# EAGLE design DigitalOutLED-02 (EAGLE 6.2)
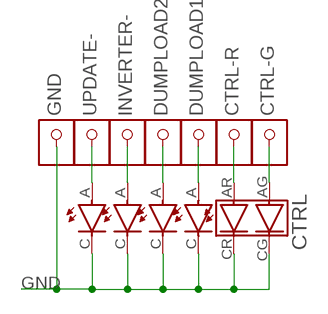
[diagram p0: schematic, sheet 1]

## Parts
CTRL  PLCC4-RG  [PLCC4]
CTRL-G  1X1HEADER  [1X1HEADER]
CTRL-R  1X1HEADER  [1X1HEADER]
DL1  PLCC2  [PLCC2]
DL2  PLCC2  [PLCC2]
DUMPLOAD1  1X1HEADER  [1X1HEADER]
DUMPLOAD2  1X1HEADER  [1X1HEADER]
GND  1X1HEADER  [1X1HEADER]
INVERTER  PLCC2  [PLCC2]
INVERTER-  1X1HEADER  [1X1HEADER]
UPDATE  PLCC2  [PLCC2]
UPDATE-  1X1HEADER  [1X1HEADER]

## Nets
GND: CTRL.CG CTRL.CR DL1.C DL2.C GND.P$1 INVERTER.C UPDATE.C
N$1: UPDATE-.P$1 UPDATE.A
N$2: INVERTER-.P$1 INVERTER.A
N$3: DL2.A DUMPLOAD2.P$1
N$4: DL1.A DUMPLOAD1.P$1
N$5: CTRL-R.P$1 CTRL.AR
N$6: CTRL-G.P$1 CTRL.AG

## Library data of the parts
CTRL = PCB_ControlStack:PLCC4-RG
CTRL-G CTRL-R DUMPLOAD1 DUMPLOAD2 GND INVERTER- UPDATE- = headers v6-2:1X1HEADER: Standard 1x1way male/female header. 2.54mm pitch. Through-Hole. Use to create custom length headers by stacking.
DL1 DL2 INVERTER UPDATE = PCB_ControlStack:PLCC2

## Board
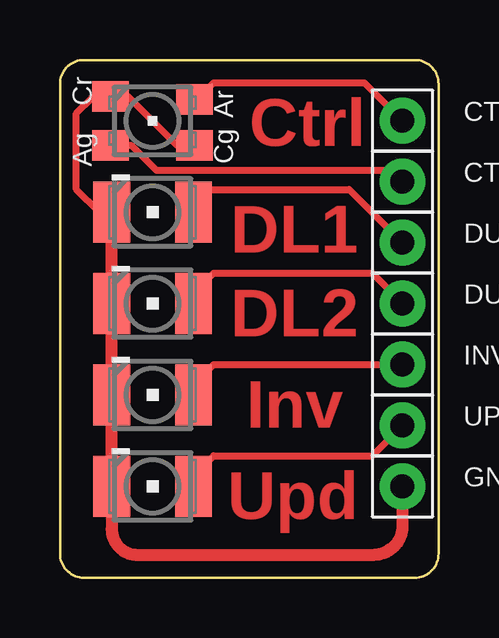
[diagram p1: board, top side]
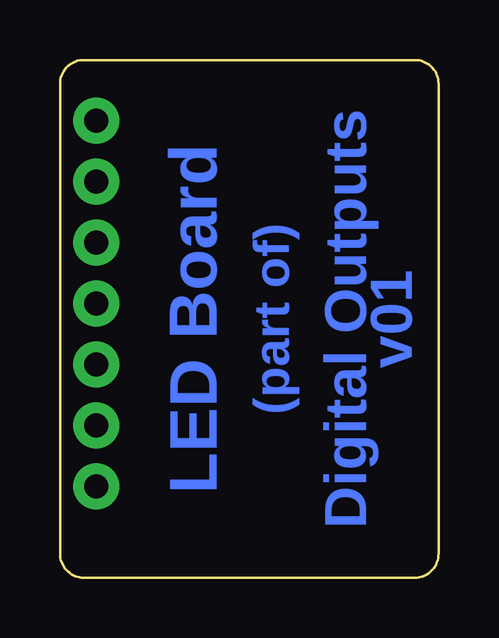
[diagram p2: board, bottom side, seen from below]

Size 15.78 x 21.59 mm. Coordinates in mm from the lower left corner, seen from the top.
Outline: 1,0 14.78,0 arc90 15.78,1 15.78,20.59 arc90 14.78,21.59 1,21.59 arc90 0,20.59 0,1 arc90 1,0
Copper layers (1*16): Top 0.035mm / dielectric 1.5mm / Bottom 0.035mm
Design rules: minimum track width 12mil, minimum drill 0.7mm, track to track 25mil, track to pad 20mil, pad to pad 15mil, via to via 20mil, smd to smd 0mil, copper to edge 30mil, drill to drill 10mil, minimum pad ring 18mil, minimum via ring 15mil, stop-mask expansion 0mil, vias tented up to drill 0mil, thermal gap 15mil

### Footprints (pad centres in the part's own frame; a part is rotated, then mirrored left to right if it is on the bottom)
PLCC4 = smd 1.27 x 1.524: AG 1.016,-1.746; AR -0.889,1.746; CG 1.016,1.746; CR -1.016,-1.746
1X1HEADER = drill 1: P$1 0,0
PLCC2 = smd 2.54 x 1.524: A 0,1.702; C 0,-1.702

### Placement (x,y rotation side)
CTRL  3.86,19.05 270 top
CTRL-G  14.27,16.51 0 top
CTRL-R  14.27,19.05 0 top
DL1  3.86,15.24 270 top
DL2  3.86,11.43 270 top
DUMPLOAD1  14.27,13.97 0 top
DUMPLOAD2  14.27,11.43 0 top
GND  14.27,3.81 0 top
INVERTER  3.86,7.62 270 top
INVERTER-  14.27,8.89 0 top
UPDATE  3.86,3.81 270 top
UPDATE-  14.27,6.35 0 top

### Tracks (layer width: path | path; a pad name or v marks a point on that pad's centre or on a via)
GND
  Top 0.3: CTRL.CG 4.87,18.03 2.84,20.07 CTRL.CR 2.05,20 1.32,20 0.68,19.37 0.68,16.19 1.63,15.24 DL1.C
  Top 0.5: DL1.C DL2.C INVERTER.C UPDATE.C 2.16,2.02 arc90 3.22,0.95 13.07,0.95 arc90 14.27,2.16 GND.P$1
N$1
  Top 0.3: UPDATE.A 5.56,4.24 6.4,5.08 13,5.08 UPDATE-.P$1
N$2
  Top 0.3: INVERTER.A 5.56,8.05 6.4,8.89 INVERTER-.P$1
N$3
  Top 0.3: DL2.A 5.56,11.86 6.4,12.7 13,12.7 DUMPLOAD2.P$1
N$4
  Top 0.3: DL1.A 5.56,15.67 6.08,16.19 12.05,16.19 DUMPLOAD1.P$1
N$5
  Top 0.3: CTRL.AR 5.7,19.94 6.4,20.64 12.68,20.64 CTRL-R.P$1
N$6
  Top 0.3: CTRL.AG 2.97,18.03 4.02,16.99 13.79,16.99 CTRL-G.P$1

### Text on the board
Top: Ctrl | DL1 | DL2 | Inv | Upd
Bottom: v01 | Digital Outputs | (part of) | LED Board